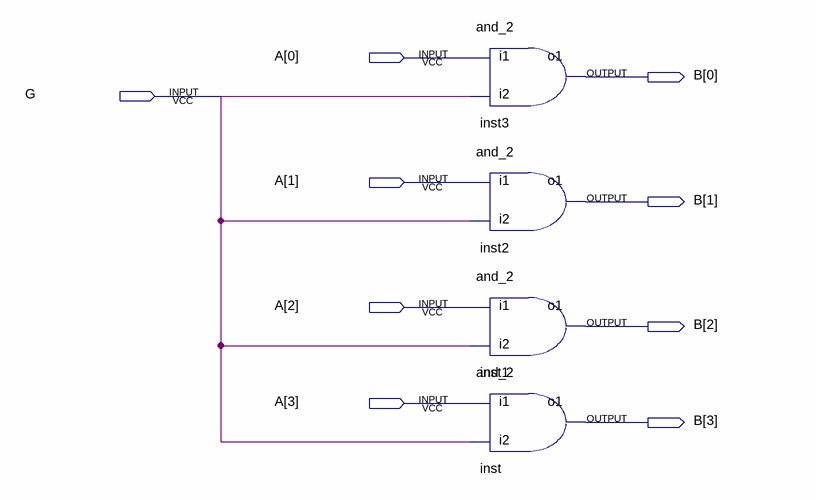
[diagram p0: schematic sheet]
// Quartus schematic GATE4.bdf as structural Verilog: 4 symbols, 9 pins
module GATE4 (
  input  [3:0] A,
  input  G,
  output [3:0] B
);

  and_2 inst3 (.i1(A[0]), .i2(G), .o1(B[0]));
  and_2 inst2 (.i1(A[1]), .i2(G), .o1(B[1]));
  and_2 inst1 (.i1(A[2]), .i2(G), .o1(B[2]));
  and_2 inst (.i1(A[3]), .i2(G), .o1(B[3]));
endmodule
